# Altium schematic sheet HMI Board_2020-12-13_21-41-40.schdoc
size 383 x 167 mm
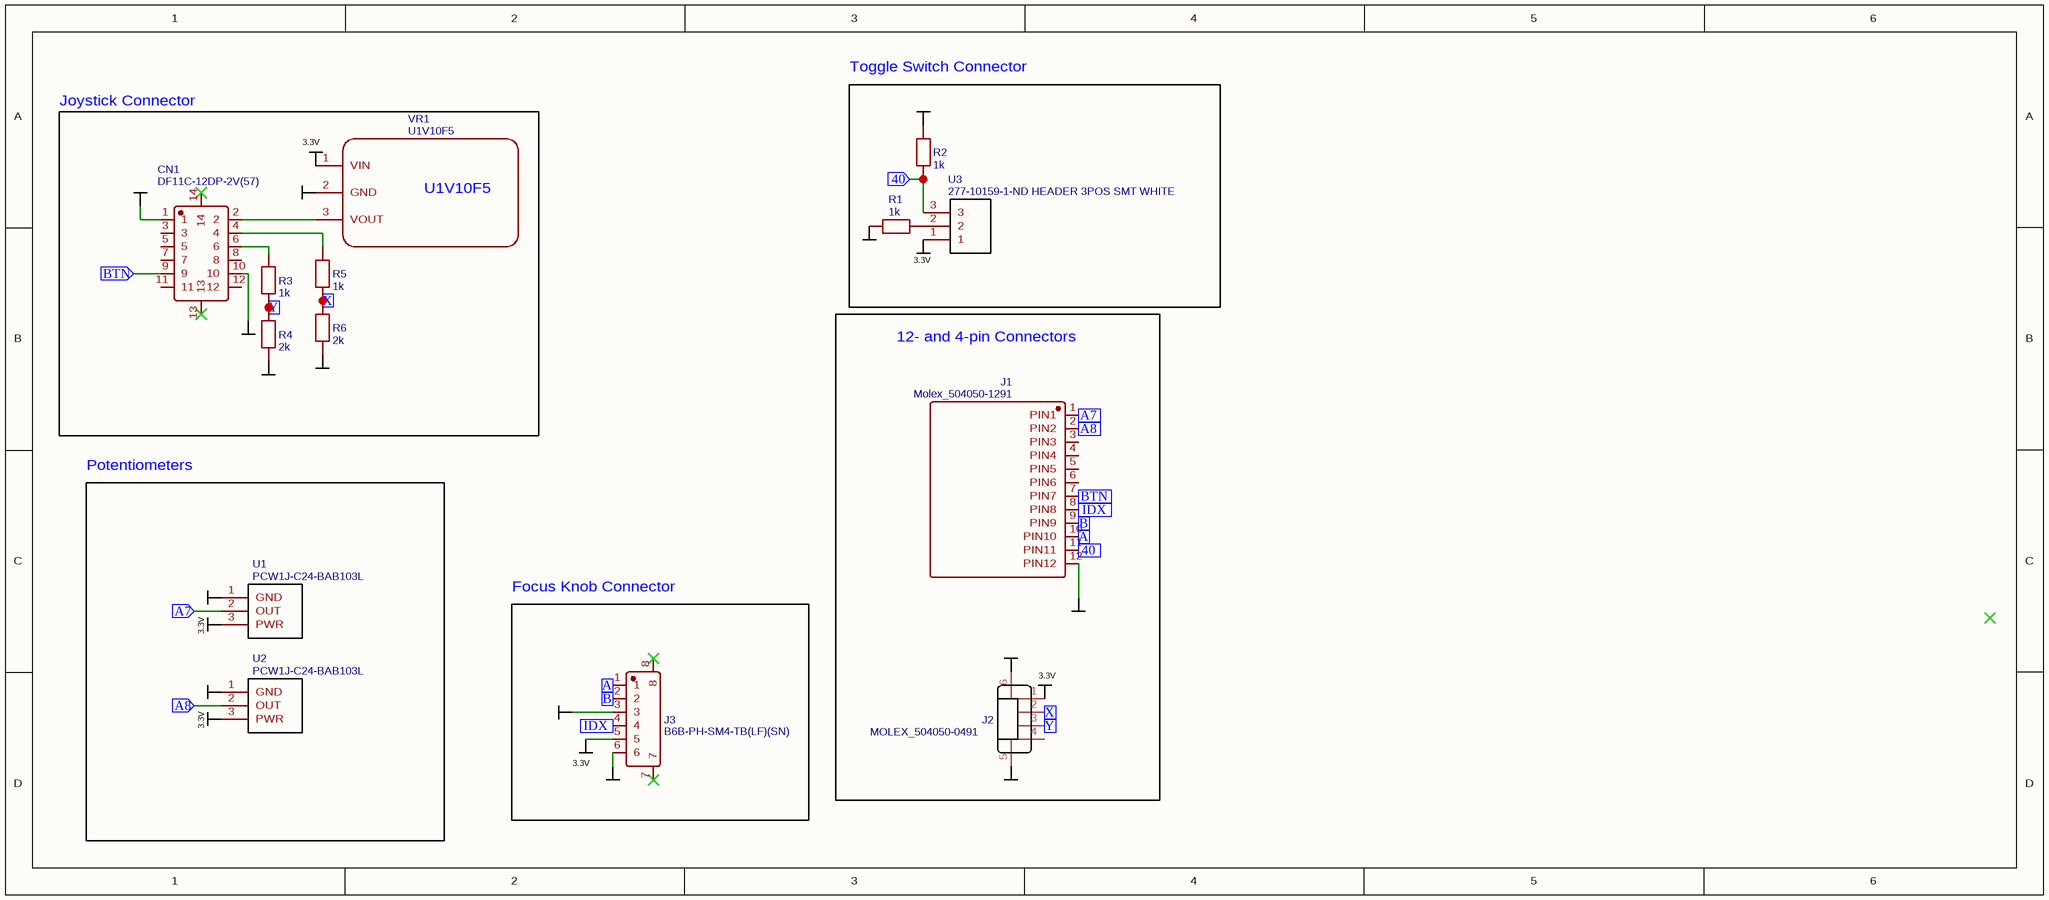
[diagram p0: HMI Board_2020-12-13_21-41-40.schdoc]

## Parts
CN1  DF11C-12DP-2V(57)  [CONN-SMD_12P-P2.00_DF11C-12DP-2V(57)]
J1  Molex_504050-1291  [MOLEX_504050-1291]
J2  MOLEX_504050-0491  [MOLEX_504050-0491]
J3  B6B-PH-SM4-TB(LF)(SN)  [CONN-SMD_6P-P2.00_B6B-PH-SM4-TB(LF)(SN)]
R1  1k  [R0805]
R2  1k  [R0805]
R3  1k  [R0805]
R4  2k  [R0805]
R5  1k  [R0805]
R6  2k  [R0805]
U1  PCW1J-C24-BAB103L  [PCW1J-C24-BAB103L]
U2  PCW1J-C24-BAB103L  [PCW1J-C24-BAB103L]
U3  277-10159-1-ND HEADER 3POS SMT WHITE  [277-10159-1-ND HEADER 3POS SMT WHITE]
VR1  U1V10F5  [U1V10F5]

## Blocks framed on the sheet
Toggle Switch Connector: R1 R2 U3
Joystick Connector: CN1 R3-R6 VR1
12- and 4-pin Connectors: J1 J2
Potentiometers: U1 U2
Focus Knob Connector: J3

## Ports
40 (in), A7 (in), A8 (in), A (in), B (in), BTN (in), IDX (in), X (in), Y (in)

## Nets
3.3V: J2.1 J3.5 U1.3(PWR) U2.3(PWR) U3.1 VR1.1(VIN)
GND: CN1.1 CN1.10 J1.12(PIN12) J2.5(MNT_1) J2.6(MNT_2) J3.3 J3.6 R1.1 R2.1 R4.1 R6.1 U1.1(GND) U2.1(GND) VR1.2(GND)
40: J1.11(PIN11) R2.2 U3.3 ; port 40
A: J1.10(PIN10) J3.1 ; port A
A7: J1.1(PIN1) U1.2(OUT) ; port A7
A8: J1.2(PIN2) U2.2(OUT) ; port A8
B: J1.9(PIN9) J3.2 ; port B
BTN: CN1.9 J1.7(PIN7) ; port BTN
IDX: J1.8(PIN8) J3.4 ; port IDX
X: J2.2 R5.1 R6.2 ; port X
Y: J2.3 R3.1 R4.2 ; port Y
NetCN1_2: CN1.2 VR1.3(VOUT)
NetCN1_4: CN1.4 R5.2
NetCN1_6: CN1.6 R3.2
NetR1_2: R1.2 U3.2

Not connected (* = marked no-connect by the designer): CN1 3 5 7 8 11 12 13* 14*; J1 3(PIN3) 4(PIN4) 5(PIN5) 6(PIN6); J2 4; J3 7* 8*

## Notes on the sheet
- (near VR1) 3.3V
- 3.3V
- (near U1) 3.3V
- (near J2) 3.3V
- (near U2) 3.3V
- (near J3) 3.3V

## Library data of the parts
CN1 = DF11C-12DP-2V(57): BOM_Manufacturer: HRS(Hirose); Contributor: LCSC; BOM_Supplier: LCSC; BOM_Supplier Part: C597834; BOM_Manufacturer Part: DF11C-12DP-2V(57); spicePre: C; spiceSymbolName: DF11C-12DP-2V(57)
J1 = Molex_504050-1291: Contributor: itai.strauss; BOM_Manufacturer Part: 504050-1291; BOM_Supplier: Digi-Key; BOM_Supplier Part: ‎WM16219CT-ND; spicePre: P; spiceSymbolName: Molex_504050-1291
J2 = MOLEX_504050-0491: BOM_Manufacturer: MOLEX; Contributor: quentin.doret.ens2m; BOM_Manufacturer Part: 504050-0491; BOM_Supplier: RS-Online; BOM_Supplier Part: 789-8359; link: https://www.molex.com/pdm_docs/sd/5040500491_sd.pdf; spicePre: J; spiceSymbolName: MOLEX_504050-0491
J3 = B6B-PH-SM4-TB(LF)(SN): BOM_Manufacturer: JST Sales America; Contributor: LCSC; BOM_Supplier: LCSC; BOM_Supplier Part: C471518; BOM_Manufacturer Part: B6B-PH-SM4-TB(LF)(SN); spicePre: C; spiceSymbolName: B6B-PH-SM4-TB(LF)(SN)
R1-R3 R5 = 1k: nameAlias: Value(Ω); Contributor: LCEDA_Lib; spicePre: R
  R1: spiceSymbolName: R_1206_EU
  R2 R3 R5: spiceSymbolName: R_0201_EU
R4 R6 = 2k: nameAlias: Value(Ω); Contributor: LCEDA_Lib; spicePre: R; spiceSymbolName: R_0201_EU
U1 U2 = PCW1J-C24-BAB103L: BOM_Manufacturer: Bourns Inc.; Contributor: nibhaa; BOM_Manufacturer Part: PCW1J-C24-BAB103L; BOM_Supplier: Digi-Key; BOM_Supplier Part: PCW1J-C24-BAB103L-ND; link: https://www.digikey.com/product-detail/en/bourns-inc/PCW1J-C24-BAB103L/PCW1J-C24-BAB103L-ND/3534177; spicePre: U; spiceSymbolName: PCW1J-C24-BAB103L
U3 = 277-10159-1-ND HEADER 3POS SMT WHITE: BOM_Manufacturer: Phoenix Contact; BOM_Manufacturer Part: 1778706; Contributor: nibhaa; BOM_Supplier: Digi-Key; BOM_Supplier Part: 277-10159-1-ND; link: https://www.digikey.com/product-detail/en/phoenix-contact/1778706/277-10159-1-ND/5131541; spicePre: U; spiceSymbolName: 277-10159-1-ND HEADER 3POS SMT WHITE
VR1 = U1V10F5: Contributor: winter2015; sourceId: YsmgyP7pj; timeStamp: 1454571851; spicePre: U; spiceSymbolName: U1V10F5